# EasyEDA Pro project LUME_PEN_EasyEDA_Project_V1.2_2026-06-28.epro, board 04_Stencil PCB
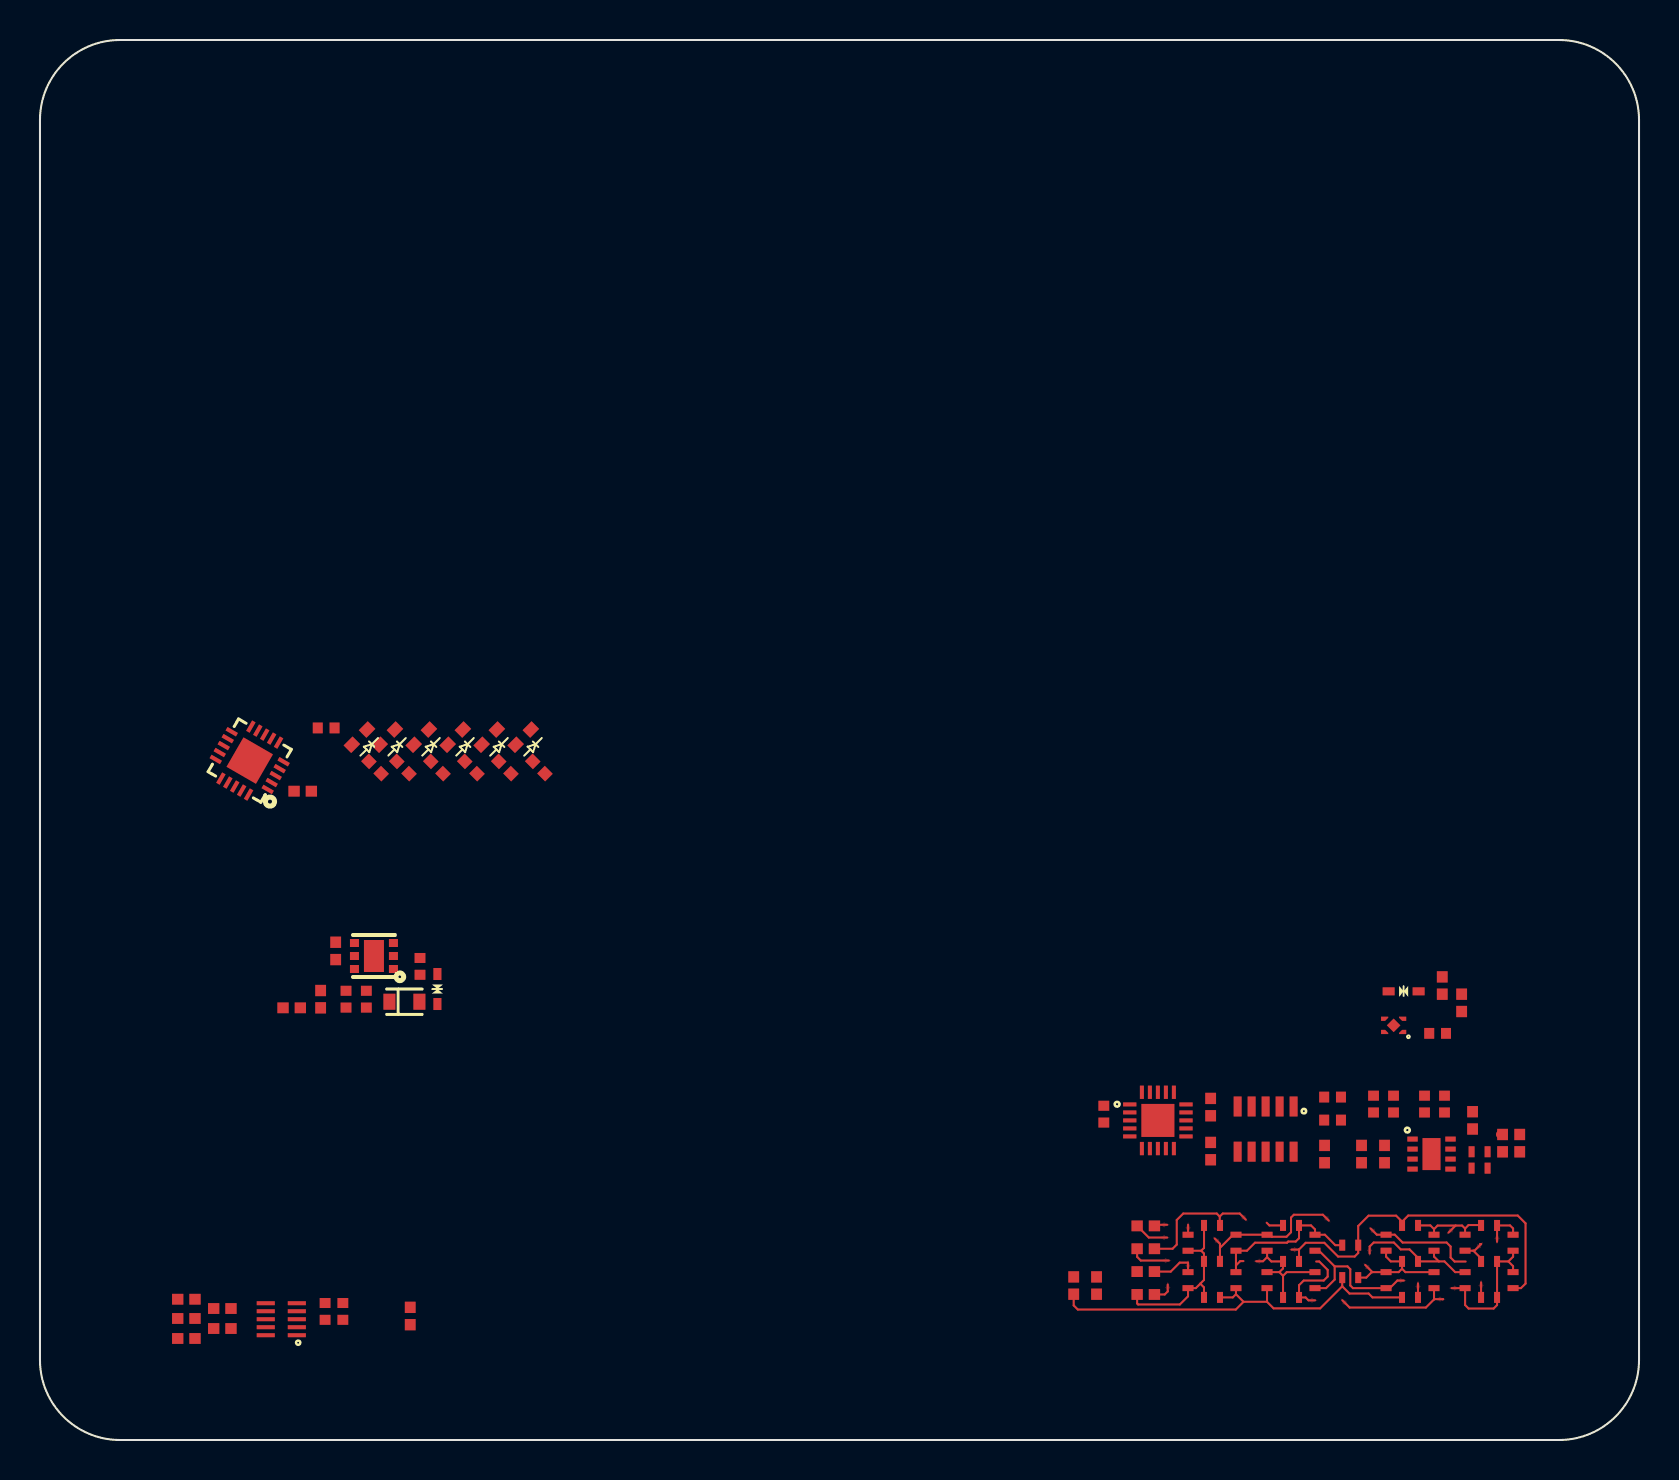
[diagram p3: board, top side]
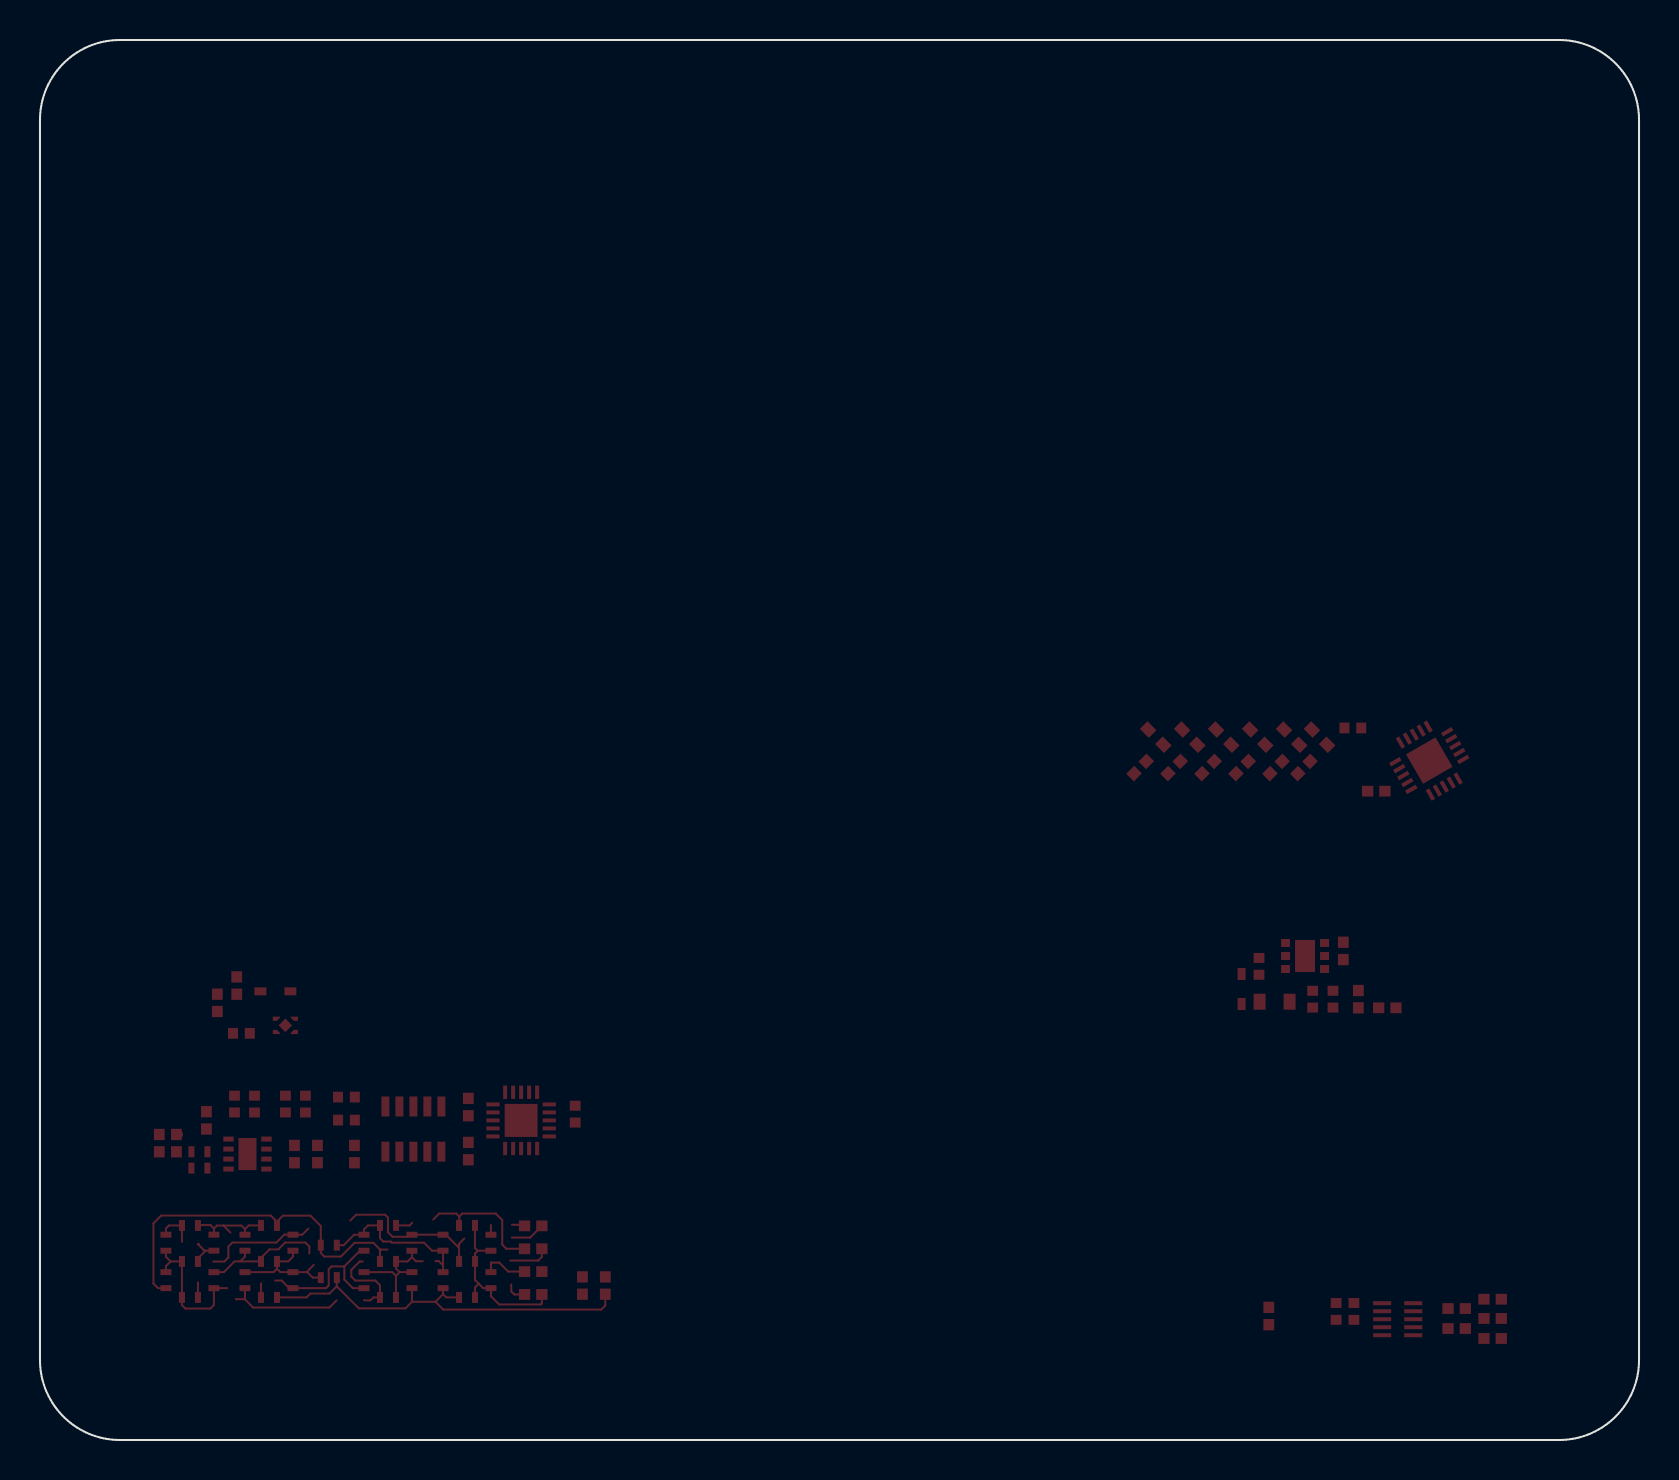
[diagram p4: board, bottom side, seen from below]

Outline 80 x 70 mm; copper layers: Top Layer, Bottom Layer. Coordinates in mm from the lower left corner of the outline.
Outline path: 0,66 0,4 arc(1.17,1.17) 4,0 76,0 arc(78.83,1.17) 80,4 80,66 arc(78.83,68.83) 76,70 4,70 arc(1.17,68.83) 0,66
Stack: Top Layer 0.035mm / Dielectric1 1.51mm FR4 er 4.5 / Bottom Layer 0.035mm

## Design rules (mm)
template: JLCPCB Capability(Two Layers Board)
spacing copperThickness1oz (default): track to track 0.102, other pairs 0.152 to 0.3
spacing copperThickness2oz: track to track 0.203, other pairs 0.152 to 0.3
track width copperThickness1oz (default): min 0.127, default 0.254, max 2.54
track width copperThickness2oz: min 0.203, default 0.254, max 2.54
differential pair differentialPair (default): width min 0.127, default 0.254, max 2.54; gap min 0.152, default 0.152
via viaSize (default): diameter min 0.5, default 0.61, max 10; hole min 0.3, default 0.305, max 6.3

## Placement (name value [footprint] x y rotation side)
C1  -  [C0402]  15.31 22.04 90 top
C1#2  -  [C0402]  64.67 16 0 top
C2  -  [C0402]  16.33 22.04 90 top
C2#2  -  [C0402]  53.22 16.29 90 top
C3  -  [C0402]  64.67 17.15 0 top
C3#2  -  [C0402]  14.32 35.6 0 top
C4  100nF  [C0402]  19.01 23.68 270 top
C5  4.7µF  [C0402]  67.72 16.8 90 top
C6  4.7µF  [C0402]  69.27 16.8 90 top
C7  100nF  [C0402]  66.72 16.8 90 top
C8  100nF  [C0402]  70.27 16.8 90 top
C9  100nF  [C0402]  14.26 6.43 90 top
C10  1µF  [C0402]  15.15 6.43 90 top
C11  1µF  [C0402]  69.92 20.33 0 top
D1  LESD5D5.0CT1G  [SOD-523_L1.2-W0.8-LS1.6-BI]  68.22 22.43 180 top
D3  RB520SM-40T2R  [SOD-523F_L1.7-W0.9-LS1.7-RD]  18.23 21.91 0 top
LED1  -  [LED0402]  72.02 14.41 0 top
LED1#2  -  [LED0402-RD_YELLOW]  15.98 35.14 225 top
LED2  -  [LED0402]  72.02 13.59 0 top
LED2#2  -  [LED0402-RD_YELLOW]  17.38 35.14 225 top
LED3  -  [LED0402]  63.79 9.86 270 top
LED3#2  -  [LED0402-RD_YELLOW]  19.08 35.14 225 top
LED4  -  [LED0402]  63.79 7.99 270 top
LED4#2  -  [LED0402-RD_YELLOW]  20.78 35.14 225 top
LED5  -  [LED0402]  67.34 7.99 270 top
LED5#2  -  [LED0402-RD_YELLOW]  22.48 35.14 225 top
LED6  -  [LED0402]  72.5 10.73 0 top
LED6#2  -  [LED0402-RD_YELLOW]  24.18 35.14 225 top
LED7  XL-1005SURC  [LED0402]  73.7 9.86 90 top
LED8  XL-1005SURC  [LED0402]  58.64 10.73 0 top
LED9  XL-1005SURC  [LED0402]  62.59 7.13 0 top
LED10  XL-1005SURC  [LED0402]  69.74 7.99 270 top
LED11  XL-1005SURC  [LED0402]  71.3 9.87 270 top
LED12  XL-1005SURC  [LED0402]  72.5 8.93 180 top
LED13  XL-1005SURC  [LED0402]  57.44 9.86 90 top
LED14  XL-1005SURC  [LED0402]  62.59 10.73 180 top
LED15  XL-1005SURC  [LED0402]  68.54 8.93 0 top
LED16  XL-1005SURC  [LED0402]  69.74 9.86 270 top
LED17  XL-1005SURC  [LED0402]  71.3 7.99 90 top
LED18  XL-1005SURC  [LED0402]  57.44 7.99 90 top
LED19  XL-1005SURC  [LED0402]  65.55 9.74 0 top
LED20  XL-1005SURC  [LED0402]  62.59 8.93 0 top
LED21  XL-1005SURC  [LED0402]  68.54 10.73 180 top
LED22  XL-1005SURC  [LED0402]  73.7 7.99 270 top
LED23  XL-1005SURC  [LED0402]  58.63 8.93 0 top
LED24  XL-1005SURC  [LED0402]  59.84 9.86 90 top
LED25  XL-1005SURC  [LED0402]  61.39 9.86 90 top
LED26  XL-1005SURC  [LED0402]  67.34 9.87 90 top
LED27  XL-1005SURC  [LED0402]  72.5 7.13 180 top
LED28  XL-1005SURC  [LED0402]  58.64 7.13 0 top
LED29  XL-1005SURC  [LED0402]  59.83 7.99 270 top
LED30  XL-1005SURC  [LED0402]  61.39 7.99 270 top
LED31  XL-1005SURC  [LED0402]  65.55 8.12 180 top
LED32  XL-1005SURC  [LED0402]  68.54 7.13 180 top
R1  -  [R0402]  14.04 22.04 270 top
R1#2  -  [R0402]  58.57 16.65 90 top
R2  -  [R0402]  14.79 24.45 90 top
R2#2  -  [R0402]  58.57 14.45 270 top
R3  -  [R0402]  13.14 32.44 0 top
R3#2  -  [R0402]  64.27 14.3 270 top
R4  -  [R0402]  16.76 33.62 135 top
R4#2  -  [R0402]  66.12 14.3 90 top
R5  -  [R0402]  18.16 33.62 135 top
R5#2  -  [R0402]  71.67 15.98 270 top
R6  -  [R0402]  19.86 33.62 135 top
R6#2  -  [R0402]  67.27 14.3 90 top
R7  -  [R0402]  21.56 33.62 135 top
R7#2  -  [R0402]  73.17 14.84 90 top
R8  -  [R0402]  74.03 14.84 90 top
R8#2  -  [R0402]  23.26 33.62 135 top
R9  -  [R0402]  24.96 33.62 135 top
R9#2  -  [R0402]  7.32 5.08 0 top
R10  -  [R0402]  12.59 21.61 0 top
R10#2  -  [R0402]  9.12 5.57 0 top
R11  0  [R0402]  7.32 6.08 0 top
R12  0  [R0402]  9.12 6.57 0 top
R13  0  [R0402]  7.32 7.04 180 top
R14  20K  [R0402]  18.52 6.2 90 top
R15  680  [R0402]  55.32 7.28 180 top
R16  680  [R0402]  55.32 9.56 180 top
R17  680  [R0402]  55.32 10.71 180 top
R18  680  [R0402]  55.32 8.42 180 top
R19  680  [R0402]  52.86 7.72 90 top
R20  680  [R0402]  51.72 7.72 90 top
R21  100K  [R0402]  70.16 22.72 90 top
R22  200K  [R0402]  71.13 21.86 90 top
TVS1  LESD5D5.0CT1G  [SOD-523_L1.2-W0.8-LS1.6-BI]  19.88 22.55 270 top
U1  -  [OSC-SMD_10P-L3.2-W2.5-BL-1]  61.32 15.55 180 top
U1#2  -  [WSON-6_L2.0-W2.0-P0.65-BL-EP]  16.71 24.2 90 top
U2  -  [QFN-20_L3.0-W3.0-P0.40-BL-EP1.7]  55.93 15.98 270 top
U2#2  -  [QFN-20_L3.0-W3.0-P0.40-TL-EP1.7]  10.49 33.97 150 top
U3  BQ25170DSGR  [WSON-8_L2.0-W2.0-P0.50-TL-EP]  69.62 14.3 0 top
U4  -  [AW93105DNR]  12.07 6.04 90 top
U5  LP5907SNX-3.0/NOPB  [X2SON-4_L1.0-W1.0-P0.65-BL-EP]  67.72 20.73 90 top

## Footprints (pads in the part's own frame, mm; a bottom-side part is the same pattern mirrored in y, then rotated)
AW93105DNR
  rect 0.2x0.905 smd: 1(-0.8,-0.777) 2(-0.4,-0.777) 3(0,-0.777) 4(0.4,-0.777) 5(0.8,-0.777) 6(0.8,0.777) 7(0.4,0.777) 8(0,0.777) 9(-0.4,0.777) 10(-0.8,0.777)
C0402
  rect 0.5x0.54 smd: 1(-0.42,0) 2(0.42,0)
LED0402
  rect 0.3x0.55 smd: 1(-0.4,0) 2(0.4,0)
LED0402-RD_YELLOW
  rect 0.636x0.54 smd: 1(-0.538,0) 2(0.538,0)
OSC-SMD_10P-L3.2-W2.5-BL-1
  rect 0.4x1 smd: 1(-1.4,-1.13) 2(-0.7,-1.13) 3(0,-1.13) 4(0.7,-1.13) 5(1.4,-1.13) 6(1.4,1.13) 7(0.7,1.13) 8(0,1.13) 9(-0.7,1.13) 10(-1.4,1.13)
QFN-20_L3.0-W3.0-P0.40-BL-EP1.7
  rect 0.2x0.665 smd: 1(-0.8,-1.407) 2(-0.4,-1.407) 3(0,-1.407) 4(0.4,-1.407) 5(0.8,-1.407) 11(0.8,1.407) 12(0.4,1.407) 13(0,1.407) 14(-0.4,1.407) 15(-0.8,1.407)
  rect 0.665x0.2 smd: 6(1.407,-0.8) 7(1.407,-0.4) 8(1.407,0) 9(1.407,0.4) 10(1.407,0.8) 16(-1.407,0.8) 17(-1.407,0.4) 18(-1.407,0) 19(-1.407,-0.4) 20(-1.407,-0.8)
  rect 1.65x1.65 smd: 21(0,0)
QFN-20_L3.0-W3.0-P0.40-TL-EP1.7
  rect 0.6x0.2 smd: 1(-1.5,0.8) 2(-1.5,0.401) 3(-1.5,0) 4(-1.5,-0.4) 5(-1.5,-0.8) 11(1.5,-0.8) 12(1.5,-0.4) 13(1.5,0) 14(1.5,0.401) 15(1.5,0.8)
  rect 0.2x0.6 smd: 6(-0.8,-1.5) 7(-0.4,-1.5) 8(0,-1.5) 9(0.4,-1.5) 10(0.799,-1.5) 16(0.8,1.5) 17(0.4,1.5) 18(0,1.5) 19(-0.4,1.5) 20(-0.8,1.5)
  rect 1.7x1.7 smd: 21(0,0)
R0402
  rect 0.566x0.54 smd: 1(-0.433,0) 2(0.433,0)
SOD-523_L1.2-W0.8-LS1.6-BI
  rect 0.6x0.4 smd: 1(-0.75,0) 2(0.75,0)
SOD-523F_L1.7-W0.9-LS1.7-RD
  rect 0.6x0.8 smd: 1(-0.75,0) 2(0.75,0)
WSON-6_L2.0-W2.0-P0.65-BL-EP
  rect 0.4x0.45 smd: 1(-0.65,-0.975) 2(0,-0.975) 3(0.65,-0.975) 4(0.65,0.975) 5(0,0.975) 6(-0.65,0.975)
  rect 1.6x1 smd: 7(0,0)
WSON-8_L2.0-W2.0-P0.50-TL-EP
  rect 0.521x0.25 smd: 1(-0.95,0.75) 2(-0.95,0.25) 3(-0.95,-0.25) 4(-0.95,-0.75) 5(0.95,-0.75) 6(0.95,-0.25) 7(0.95,0.25) 8(0.95,0.75)
  rect 0.9x1.6 smd: 9(0,0)
X2SON-4_L1.0-W1.0-P0.65-BL-EP
  custom 0.21x0.36 smd: 1(-0.33,-0.45) 2(0.33,-0.45) 3(0.33,0.45) 4(-0.33,0.45)
  rect 0.48x0.48 smd rot 135: 5(0,0)

## Nets
3.0V: C2#2.1 C3.1 C9.1 C10.1 C11.1 R1#2.2 R2#2.2 R3#2.2 R14.2 U1.1 U1.3 U1.8 U2.4 U4.4 U5.1
5V_IN: D3.2 TVS1.2
5V_POGO: U1#2.1
5V_POGO_EN: R2.2 U1#2.4 U2#2.3
GND: C1.2 C1#2.2 C2.2 C2#2.2 C3.2 C3#2.2 C4.2 C5.2 C6.2 C7.2 C8.2 C9.2 C10.2 C11.2 D1.1 LED1#2.1 LED2#2.1 LED3#2.1 LED4#2.1 LED5#2.1 LED6#2.1 R2.1 R4#2.1 R5#2.1 R6#2.1 R22.1 TVS1.1 U1.9 U1#2.5 U1#2.7 U2.3 U2.21 U2#2.4 U2#2.21 U3.4 U3.9 U4.5 U5.2 U5.5
VBAT.SENSE: R21.1 R22.2 U2.1
VBUS: C1.1 C2.1 C3#2.1 C4.1 D3.1 R1.2 R3.2 R10.2 U1#2.2 U1#2.6 U2#2.6
VCC: C6.1 C8.1 D1.2 R7#2.2 R8.2 R21.2 U3.8 U5.3 U5.4
VIN: C5.1 C7.1 U3.1
AW.NINT: R14.1 U2.12 U4.10
C0: R11.1
C1: R12.1
C2: R13.2
C3: R10#2.1
C4: R9#2.1
EVIN: U1.6
L1: LED8.1 LED13.1 LED18.1 LED23.1 LED28.1 R15.2 U2.7
L2: LED3.1 LED14.1 LED19.1 LED24.1 LED29.1 R16.2 U2.9
L3: LED4.1 LED9.1 LED20.1 LED25.1 LED30.1 R17.2 U2.10
L4: LED5.1 LED10.1 LED15.1 LED26.1 LED31.1 R18.2 U2.8
L5: LED6.1 LED11.1 LED16.1 LED21.1 LED32.1 R19.2 U2.6
L6: LED7.1 LED12.1 LED17.1 LED22.1 LED27.1 R20.2 U2.5
LED_R: R4.1 U2#2.18
LED_W1: R9.1 U2#2.7
LED_W2: R5.1 U2#2.17
LED_W3: R6.1 U2#2.16
LED_W4: R7.1 U2#2.11
LED_W5: R8#2.1 U2#2.10
NFAULT: R1.1 U1#2.3 U2#2.5
RTC.NINT: R3#2.1 U1.10 U2.11
RTC.VOUT: C1#2.1 U1.2
SCL: R1#2.1 U1.5 U2.14 U4.1
SDA: R2#2.1 U1.7 U2.13 U4.2
SENSE: R10.1 U2#2.20
SWIO: U2#2.15
UPDI: U2.19
VSET: R5#2.2 U3.7
$1N881: R3.1 U2#2.1
$1N1138: LED6#2.2 R9.2
$1N1214: LED2#2.2 R5.2
$1N1287: LED3#2.2 R6.2
$1N1308: R4#2.2 U3.2
$1N1353: R6#2.2 U3.3
$1N1360: LED4#2.2 R7.2
$1N1433: LED5#2.2 R8#2.2
$1N1609: LED1#2.2 R4.2
$1N1786: LED1.2 R7#2.1
$1N1791: LED2.2 R8.1
$1N1797: LED2.1 U3.5
$1N1804: LED1.1 U3.6
$1N2356: R12.2 U4.6
$1N2362: R11.2 U4.7
$1N2368: R10#2.2 U4.8
$1N2375: R9#2.2 U4.9
$1N2409: R13.1 U4.3
$1N4813: LED3.2 LED4.2 LED5.2 LED6.2 LED7.2 R15.1
$1N4816: LED8.2 LED9.2 LED10.2 LED11.2 LED12.2 R16.1
$1N4817: LED18.2 LED19.2 LED20.2 LED21.2 LED22.2 R18.1
$1N4818: LED13.2 LED14.2 LED15.2 LED16.2 LED17.2 R17.1
$1N4825: LED23.2 LED24.2 LED25.2 LED26.2 LED27.2 R19.1
$1N5378: LED28.2 LED29.2 LED30.2 LED31.2 LED32.2 R20.1

Pads without a net: U1 4; U2 2 15 16 17 18 20; U2#2 2 8 9 12 13 14 19

## Routing (per net, layer and track width the routed paths; a pad name or vN(x,y) marks a point on that pad's centre or on a via; arc(x,y) is an arc through that point)
VBAT.SENSE: length 0
  Top Layer w0.102: 71.14,22.3 arc(71.13,22.3) 71.13,22.29
VCC: length 0.1
  Top Layer w0.4: R7#2.2 73.04,15.28
C3: length 0
  Top Layer w0.102: 8.69,5.57 8.68,5.57 ; 8.68,5.57 8.68,5.57 arc(8.68,5.57) 8.69,5.57 arc(8.69,5.57) 8.68,5.57
L1: length 8.8
  Top Layer w0.102: 58.1,9.46 58.23,9.32 LED23.1 58.23,8 58.05,7.82 ; 58.1,9.46 LED13.1 ; 58.1,9.46 58.24,9.6 LED8.1 ; R15.2 54.89,6.83 54.94,6.78 57.03,6.78 57.44,7.19 LED18.1 57.83,7.59 58.05,7.82 ; LED28.1 58.24,7.63 58.05,7.82
L2: length 10.4
  Top Layer w0.102: R16.2 54.89,9.16 55.07,8.97 56.47,8.97 ; 59.83,8.73 60.05,8.94 60.21,8.94 ; 59.83,8.73 LED24.1 60.38,9.46 60.78,9.86 62.39,9.86 62.45,9.92 62.82,9.92 62.99,10.09 LED14.1 63.59,10.73 63.79,10.53 LED3.1 64.28,10.26 64.81,9.74 LED19.1 ; 59.83,8.73 LED29.1
L3: length 7.8
  Top Layer w0.102: 62.19,8.21 62.01,8.39 ; 62.19,8.21 62.37,8.39 LED4.1 ; 62.19,8.21 LED9.1 ; 62.01,8.39 62.19,8.58 LED20.1 61.61,8.93 61.39,9.14 ; 62.01,8.39 LED30.1 ; 61.39,9.14 61.19,8.94 60.85,8.94 ; 61.39,9.14 LED25.1 ; 56.39,10.12 55.47,10.12 R17.2
L4: length 6.1
  Top Layer w0.102: 68.14,8.56 68.31,8.39 LED10.1 ; 68.14,8.56 67.97,8.39 LED5.1 66.66,8.39 ; 68.14,8.56 LED15.1 67.58,8.93 67.34,9.17 LED26.1 ; LED31.1 66.36,8.12 66.63,8.39 66.66,8.39 ; 66.66,8.39 66.3,8.75
L5: length 5.2
  Top Layer w0.102: 71.3,10.57 71.47,10.75 72.08,10.75 LED6.1 ; 71.3,10.57 71.15,10.72 70.82,10.72 ; 71.3,10.57 LED11.1 ; 70.82,10.72 69.92,10.72 69.74,10.54 ; 70.82,10.72 70.47,10.37 ; 69.74,10.54 69.56,10.73 LED21.1 ; 69.74,10.54 69.74,10.27 ; LED32.1 68.94,7.83
L6: length 7.3
  Top Layer w0.102: 73.46,8.93 73.7,9.17 LED7.1 ; 73.46,8.93 LED12.1 LED27.1 72.9,6.75 72.72,6.57 71.47,6.57 71.3,6.75 LED17.1 70.62,7.59 ; 73.46,8.93 73.7,8.69 LED22.1
NFAULT: length 0.1
  Top Layer w0.127: U1#2.3 17.78,24.95
$1N4813: length 10.7
  Top Layer w0.102: 72.89,9.92 72.9,9.93 LED6.2 73.55,10.73 73.7,10.58 LED7.2 ; 64.77,8.68 63.99,9.46 LED3.2 ; 64.77,8.68 64.77,8.02 64.34,7.59 LED4.2 ; 64.77,8.68 65.42,8.68 65.55,8.54 65.55,7.73 65.69,7.59 LED5.2 67.53,7.59 67.91,7.97 68.23,7.97 ; 56.42,7.77 56.42,7.43 56.27,7.28 55.76,7.28
$1N4816: length 18.5
  Top Layer w0.102: LED12.2 72.1,9.08 71.71,9.47 ; 71.71,9.47 71.77,9.47 72.1,9.8 72.04,9.8 ; 71.71,9.47 LED11.2 ; 59.02,11.17 58.87,11.32 57.2,11.32 56.87,11 56.87,9.77 56.66,9.56 55.76,9.56 ; 59.02,11.17 59.17,11.32 60.02,11.32 60.32,11.02 ; 59.02,11.17 59.02,10.74 LED8.2 ; 69.74,7.03 69.76,7.04 70.19,7.04 70.18,7.03 ; 69.74,7.03 69.34,6.62 65.52,6.62 65.16,6.99 ; 69.74,7.03 LED10.2 ; 63.79,6.98 63.46,6.98 63.32,7.13 LED9.2 62.99,7.74 63.22,7.97 64.22,7.97 64.42,8.17 64.42,8.51 64,8.93 63.85,8.93
$1N4817: length 21.1
  Top Layer w0.102: 62.99,9.53 LED20.2 ; 62.99,9.53 62.98,9.52 62.61,9.52 ; 62.99,9.53 63.32,9.86 64.26,9.86 64.94,9.17 65.77,9.17 65.95,9.35 LED19.2 65.95,10.7 66.47,11.22 67.85,11.22 68.15,10.92 ; 68.15,10.92 68.45,11.22 73.93,11.22 74.32,10.83 74.32,7.82 74.09,7.59 LED22.2 ; 68.15,10.92 68.18,10.88 ; 68.15,10.92 68.14,10.91 LED21.2 ; LED18.2 57.44,8.87 57.02,8.87 56.57,8.42 55.76,8.42
$1N4818: length 8.6
  Top Layer w0.102: LED14.2 61.51,10.73 61.37,10.86 ; 69.98,8.93 LED15.2 68.94,9.11 68.52,9.53 68.08,9.53 67.73,9.87 66.72,9.87 66.52,9.67 66.52,9.32 ; 69.98,8.93 70.27,8.93 70.8,8.39 LED17.2 ; 69.98,8.93 69.74,9.17 LED16.2 ; LED13.2 57.44,10.76 ; 55.76,10.71 55.81,10.76 56.39,10.76
$1N4825: length 14.5
  Top Layer w0.102: 59.03,9.61 59.69,10.26 61.39,10.26 ; 59.03,9.61 59.03,9.81 58.77,10.07 ; 59.03,9.61 LED23.2 ; LED25.2 61.53,10.26 61.64,10.16 62.36,10.16 62.59,10.39 62.59,11.12 62.73,11.26 64.18,11.26 64.47,10.97 ; LED27.2 72.1,7.88 ; 71.32,8.92 70.77,8.92 70.57,9.12 70.57,9.67 70.37,9.87 68.17,9.87 67.78,10.27 LED26.2 66.88,10.27 66.57,10.57
$1N5378: length 20.9
  Top Layer w0.102: 59.83,7.29 LED29.2 ; 59.83,7.29 59.67,7.13 LED28.2 ; 59.83,7.29 60.21,6.91 ; 65.15,7.69 LED31.2 ; 65.15,7.69 65.51,7.32 66.47,7.32 66.67,7.13 LED32.2 ; 65.15,7.69 64.05,6.58 61.72,6.58 61.39,6.91 ; 61.39,6.91 60.21,6.91 ; 61.39,6.91 LED30.2 ; 60.21,6.91 59.83,6.52 51.92,6.52 51.72,6.73 R20.1

Small or netless copper shapes (teardrops, artwork), in the pictures only: 25 on Top Layer

## Text on the board
Document Layer: Stencil PCB: / nothing connected, just the component placement and light mask stencil / Silkscreen Studio
